# EAGLE schematic esp32-plc (EAGLE 9.6.2)

## Sheet 1 of 2
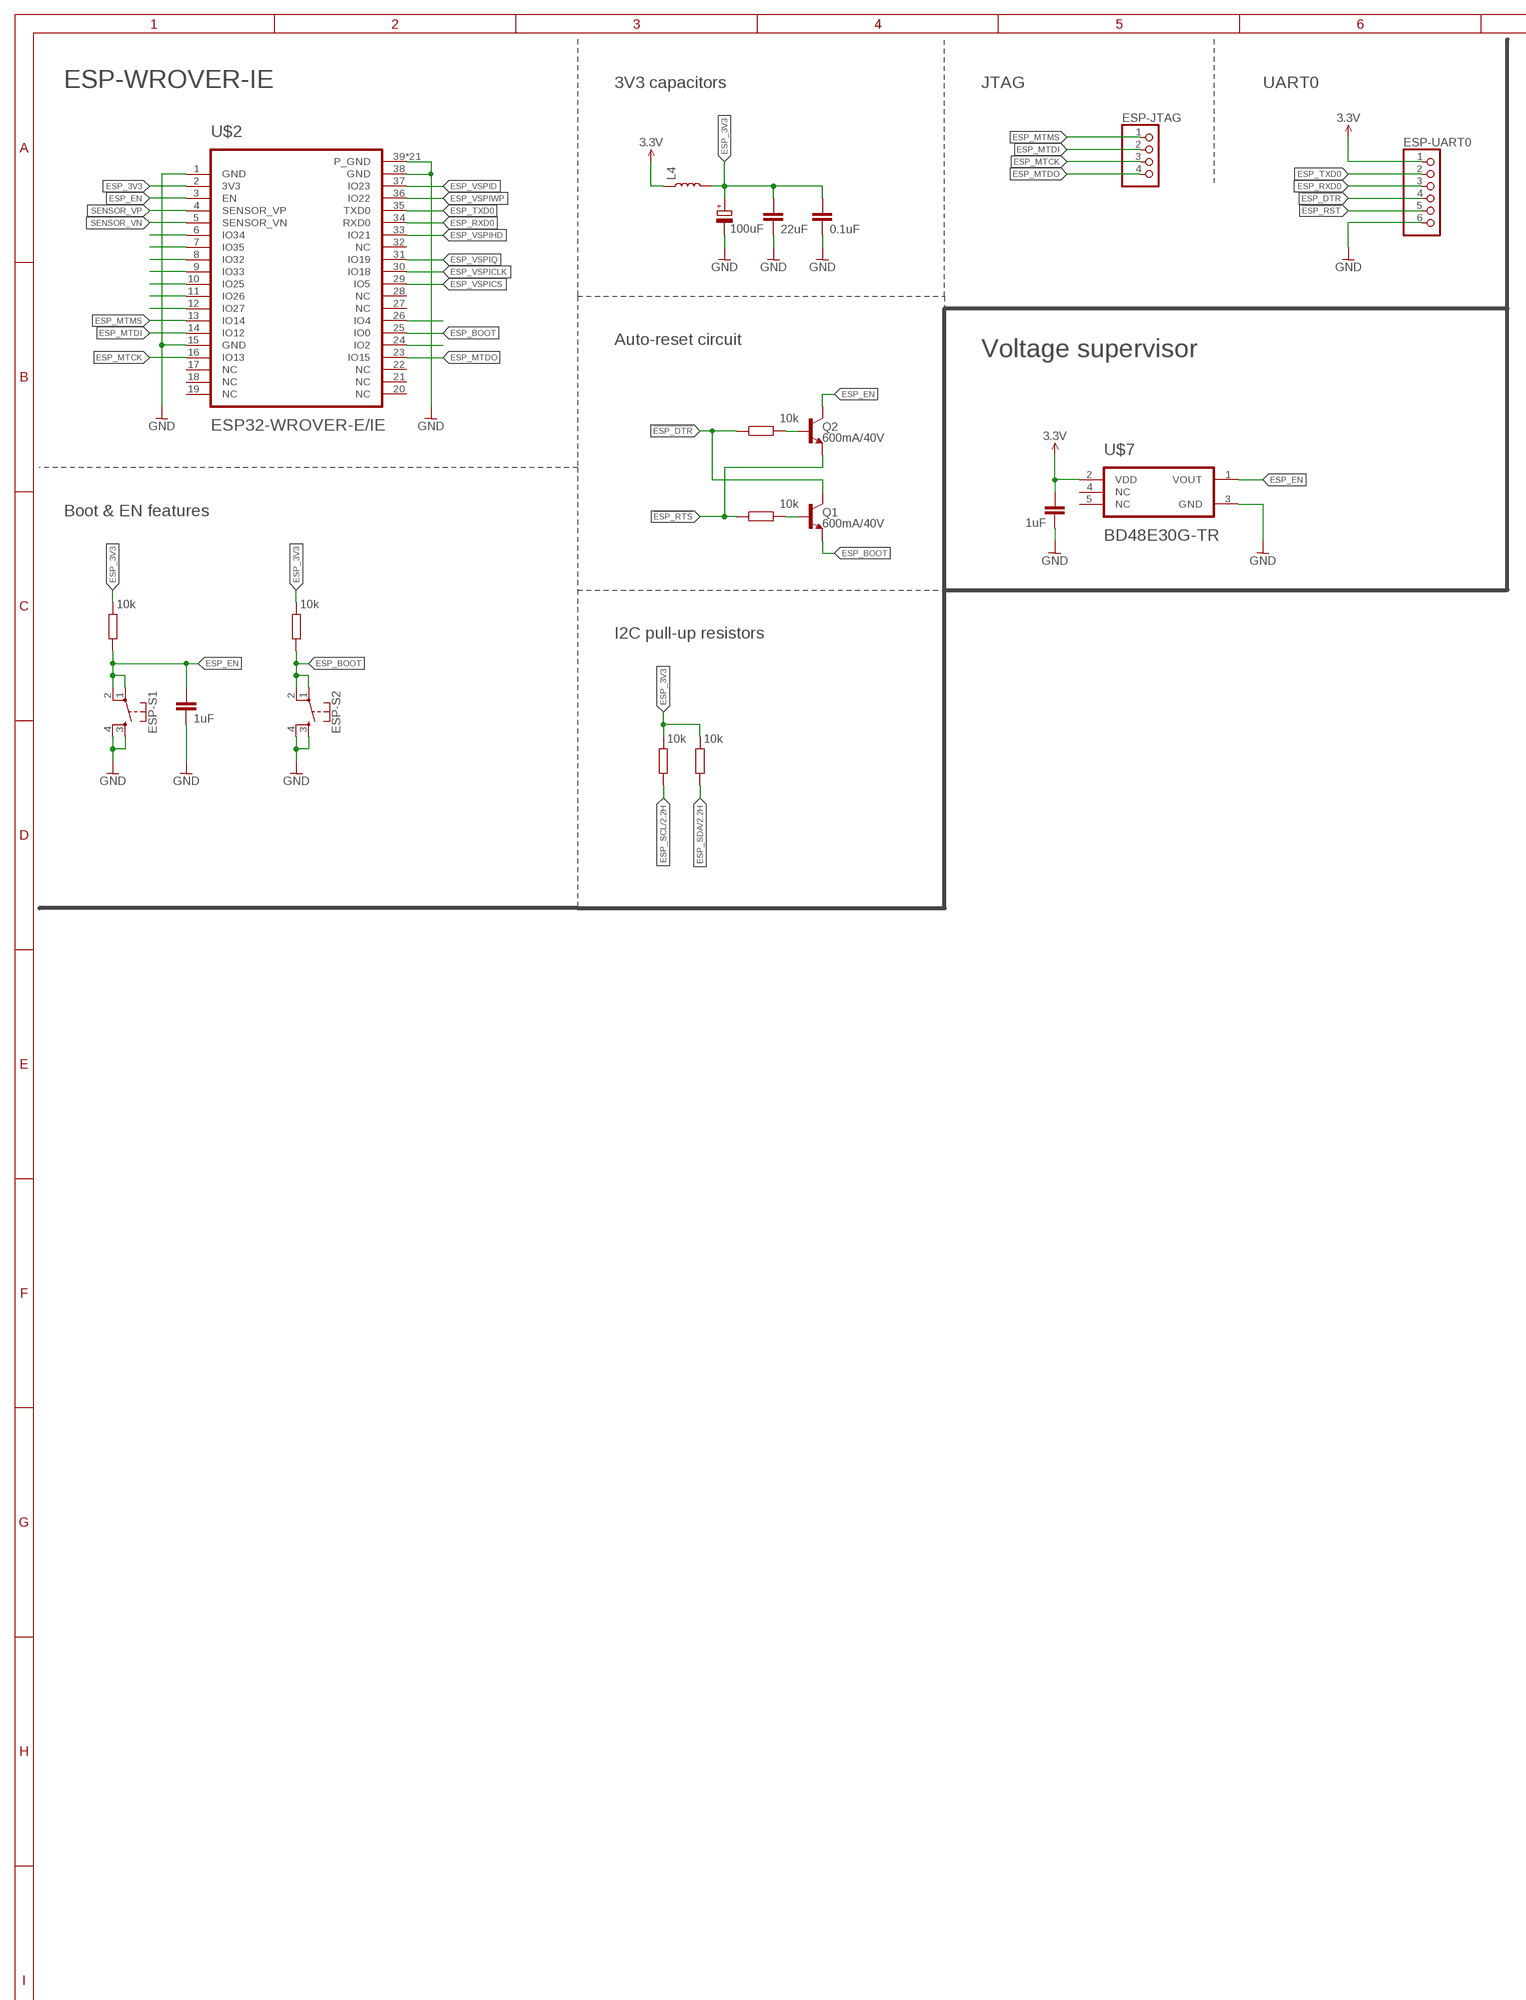
[diagram p0: schematic, sheet 1, part 1 of 2]
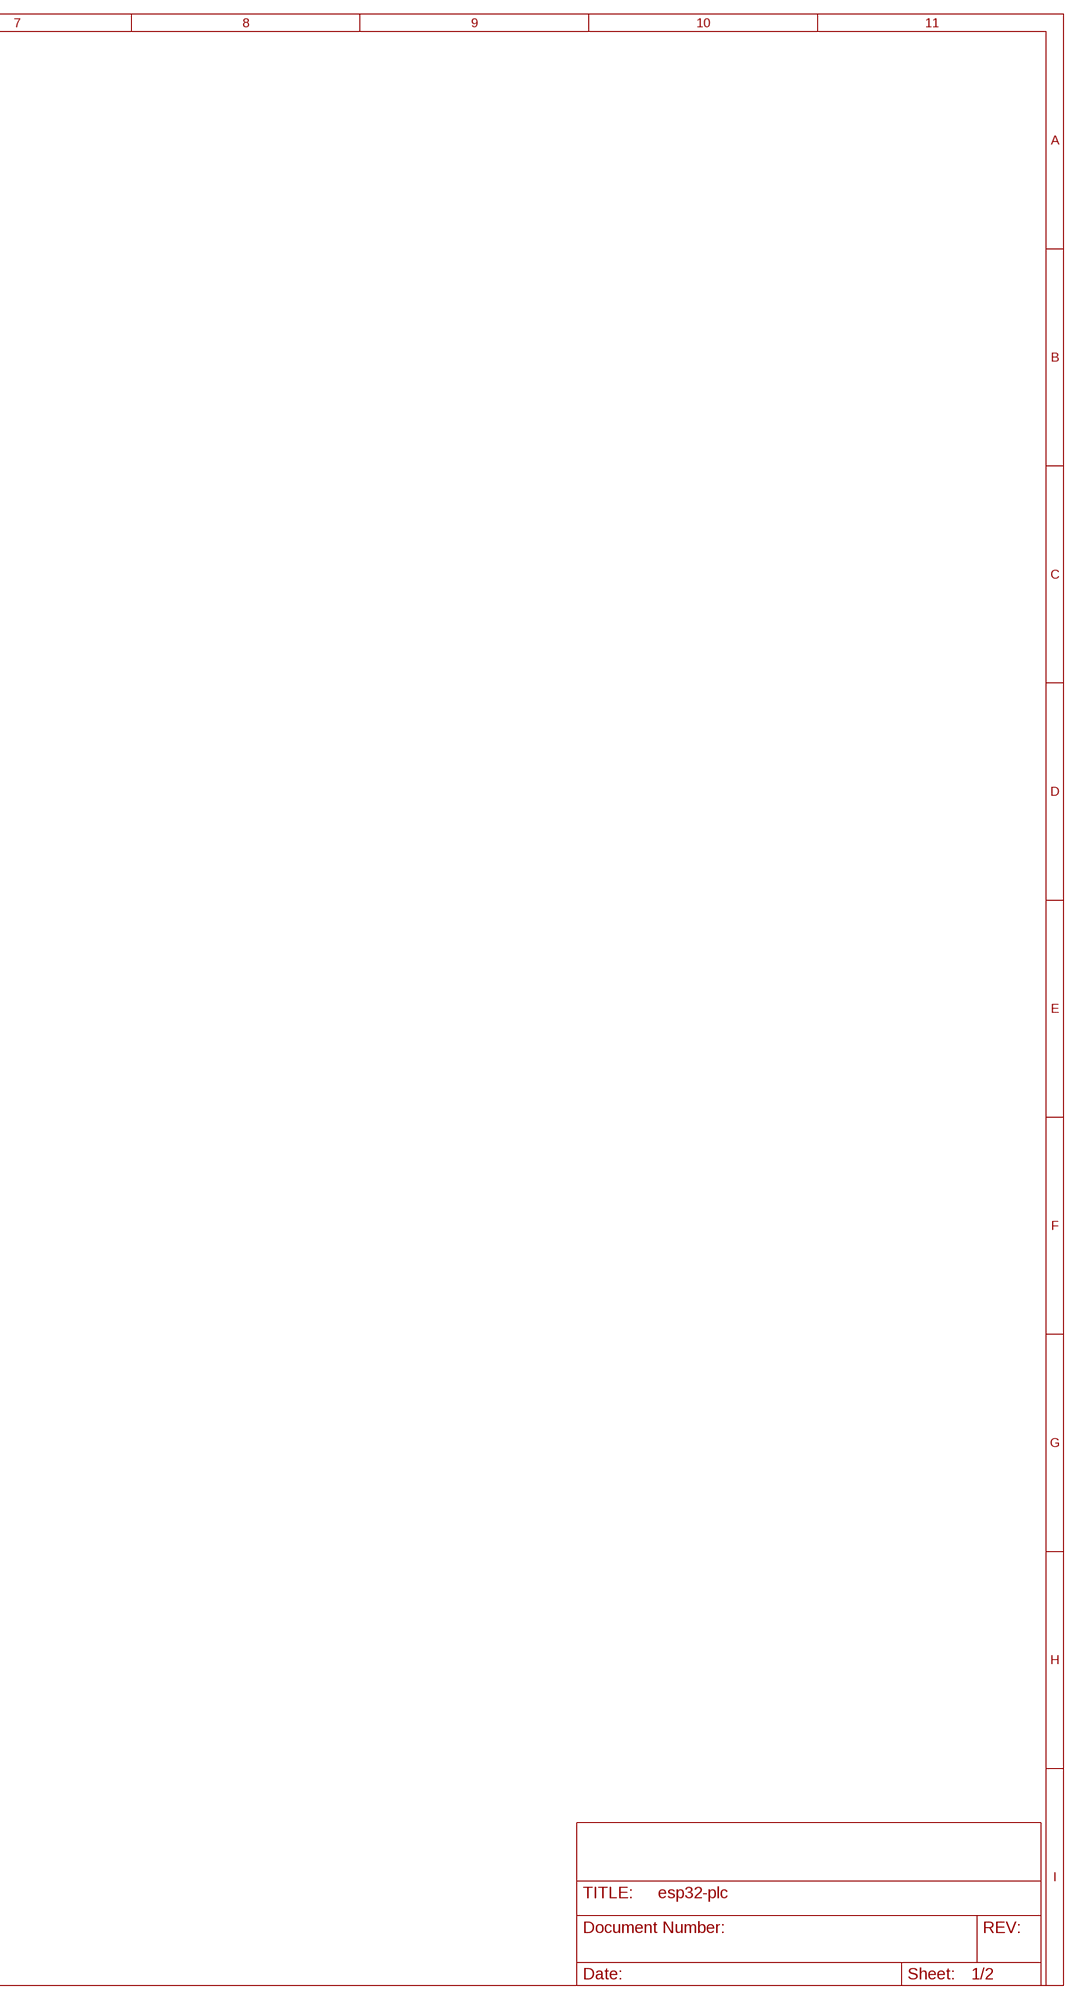
[diagram p1: schematic, sheet 1, part 2 of 2]

### Parts
ESP-C1  22uF  C-EUC0402  [C0402]
ESP-C2  0.1uF  C-EUC0402  [C0402]
ESP-C3  1uF  C-EUC0402  [C0402]
ESP-JTAG  PINHD-1X4  [1X04]
ESP-R1  10k  R-EU_R0402  [R0402]
ESP-R2  10k  R-EU_R0402  [R0402]
ESP-R3  10k  R-EU_R0402  [R0402]
ESP-R4  10k  R-EU_R0402  [R0402]
ESP-R5  10k  R-EU_R0402  [R0402]
ESP-R6  10k  R-EU_R0402  [R0402]
ESP-S1  MOMENTARY-SWITCH-SPST-2-SMD-4.6X2.8MM  [TACTILE_SWITCH_SMD_4.6X2.8MM]
ESP-S2  MOMENTARY-SWITCH-SPST-2-SMD-4.6X2.8MM  [TACTILE_SWITCH_SMD_4.6X2.8MM]
ESP-UART0  PINHD-1X6  [1X06]
L4  INDUCTOR  [XFL4020]
LTE-VBAT-C11  100uF  CPOL-EUC/6032-28R  [C/6032-28R]
Q1  600mA/40V  TRANS_NPN-MMBT2222AL  [SOT23-3]
Q2  600mA/40V  TRANS_NPN-MMBT2222AL  [SOT23-3]
U$2  ESP32-WROVER-E/IE  [ESP32-WROVER-E/IE]
U$7  BD48E30G-TR  [SSOP5]
VS-C1  1uF  C-EUC0402  [C0402]

### Nets
3.3V: ESP-UART0.1 L4.P$1 U$7.2(VDD) VS-C1.1 ; also sheet 2
!ESP_DTR: ESP-R1.1 ESP-UART0.4 Q1.3(C)
!ESP_RST: ESP-UART0.5
!ESP_RTS: ESP-R2.1 Q2.2(E)
ESP_3V3: ESP-C1.1 ESP-C2.1 ESP-R3.2 ESP-R4.2 ESP-R5.2 ESP-R6.2 L4.P$2 LTE-VBAT-C11.+ U$2.2(3V3)
ESP_BOOT: ESP-R4.1 ESP-S2.1 ESP-S2.2 Q1.2(E) U$2.25(IO0)
ESP_EN: ESP-C3.1 ESP-R3.1 ESP-S1.1 ESP-S1.2 Q2.3(C) U$2.3(EN) U$7.1(VOUT)
ESP_MTCK: ESP-JTAG.3 U$2.16(IO13)
ESP_MTDI: ESP-JTAG.2 U$2.14(IO12)
ESP_MTDO: ESP-JTAG.4 U$2.23(IO15)
ESP_MTMS: ESP-JTAG.1 U$2.13(IO14)
ESP_RXD0: ESP-UART0.3 U$2.34(RXD0)
ESP_SCL: ESP-R5.1 ; also sheet 2
ESP_SDA: ESP-R6.1 ; also sheet 2
ESP_TXD0: ESP-UART0.2 U$2.35(TXD0)
ESP_VSPICLK: U$2.30(IO18)
ESP_VSPICS: U$2.29(IO5)
ESP_VSPID: U$2.37(IO23)
ESP_VSPIHD: U$2.33(IO21)
ESP_VSPIQ: U$2.31(IO19)
ESP_VSPIWP: U$2.36(IO22)
GND: ESP-C1.2 ESP-C2.2 ESP-C3.2 ESP-S1.3 ESP-S1.4 ESP-S2.3 ESP-S2.4 ESP-UART0.6 LTE-VBAT-C11.- U$2.1(GND) U$2.15(GND) U$2.38(GND) U$2.39(P_GND) U$2.40(P_GND) U$2.41(P_GND) U$2.42(P_GND) U$2.43(P_GND) U$2.44(P_GND) U$2.45(P_GND) U$2.46(P_GND) U$2.47(P_GND) U$2.48(P_GND) U$2.49(P_GND) U$2.50(P_GND) U$2.51(P_GND) U$2.52(P_GND) U$2.53(P_GND) U$2.54(P_GND) U$2.55(P_GND) U$2.56(P_GND) U$2.57(P_GND) U$2.58(P_GND) U$2.59(P_GND) U$7.3(GND) VS-C1.2 ; also sheet 2
N$14: U$2.12(IO27)
N$15: U$2.11(IO26)
N$16: U$2.10(IO25)
N$17: U$2.9(IO33)
N$18: U$2.8(IO32)
N$19: U$2.7(IO35)
N$20: U$2.6(IO34)
N$27: U$2.26(IO4)
N$29: ESP-R2.2 Q1.1(B)
N$30: ESP-R1.2 Q2.1(B)
N$31: U$2.24(IO2)
SENSOR_VN: U$2.5(SENSOR_VN)
SENSOR_VP: U$2.4(SENSOR_VP)
Unconnected: U$2.17(NC) U$2.18(NC) U$2.19(NC) U$2.20(NC) U$2.21(NC) U$2.22(NC) U$2.27(NC) U$2.28(NC) U$2.32(NC) U$7.4(NC) U$7.5(NC)

### Notes on the sheet
- ESP-WROVER-IE | 3V3 capacitors | JTAG | UART0
- Auto-reset circuit
- Voltage supervisor
- Boot & EN features
- I2C pull-up resistors

## Sheet 2 of 2
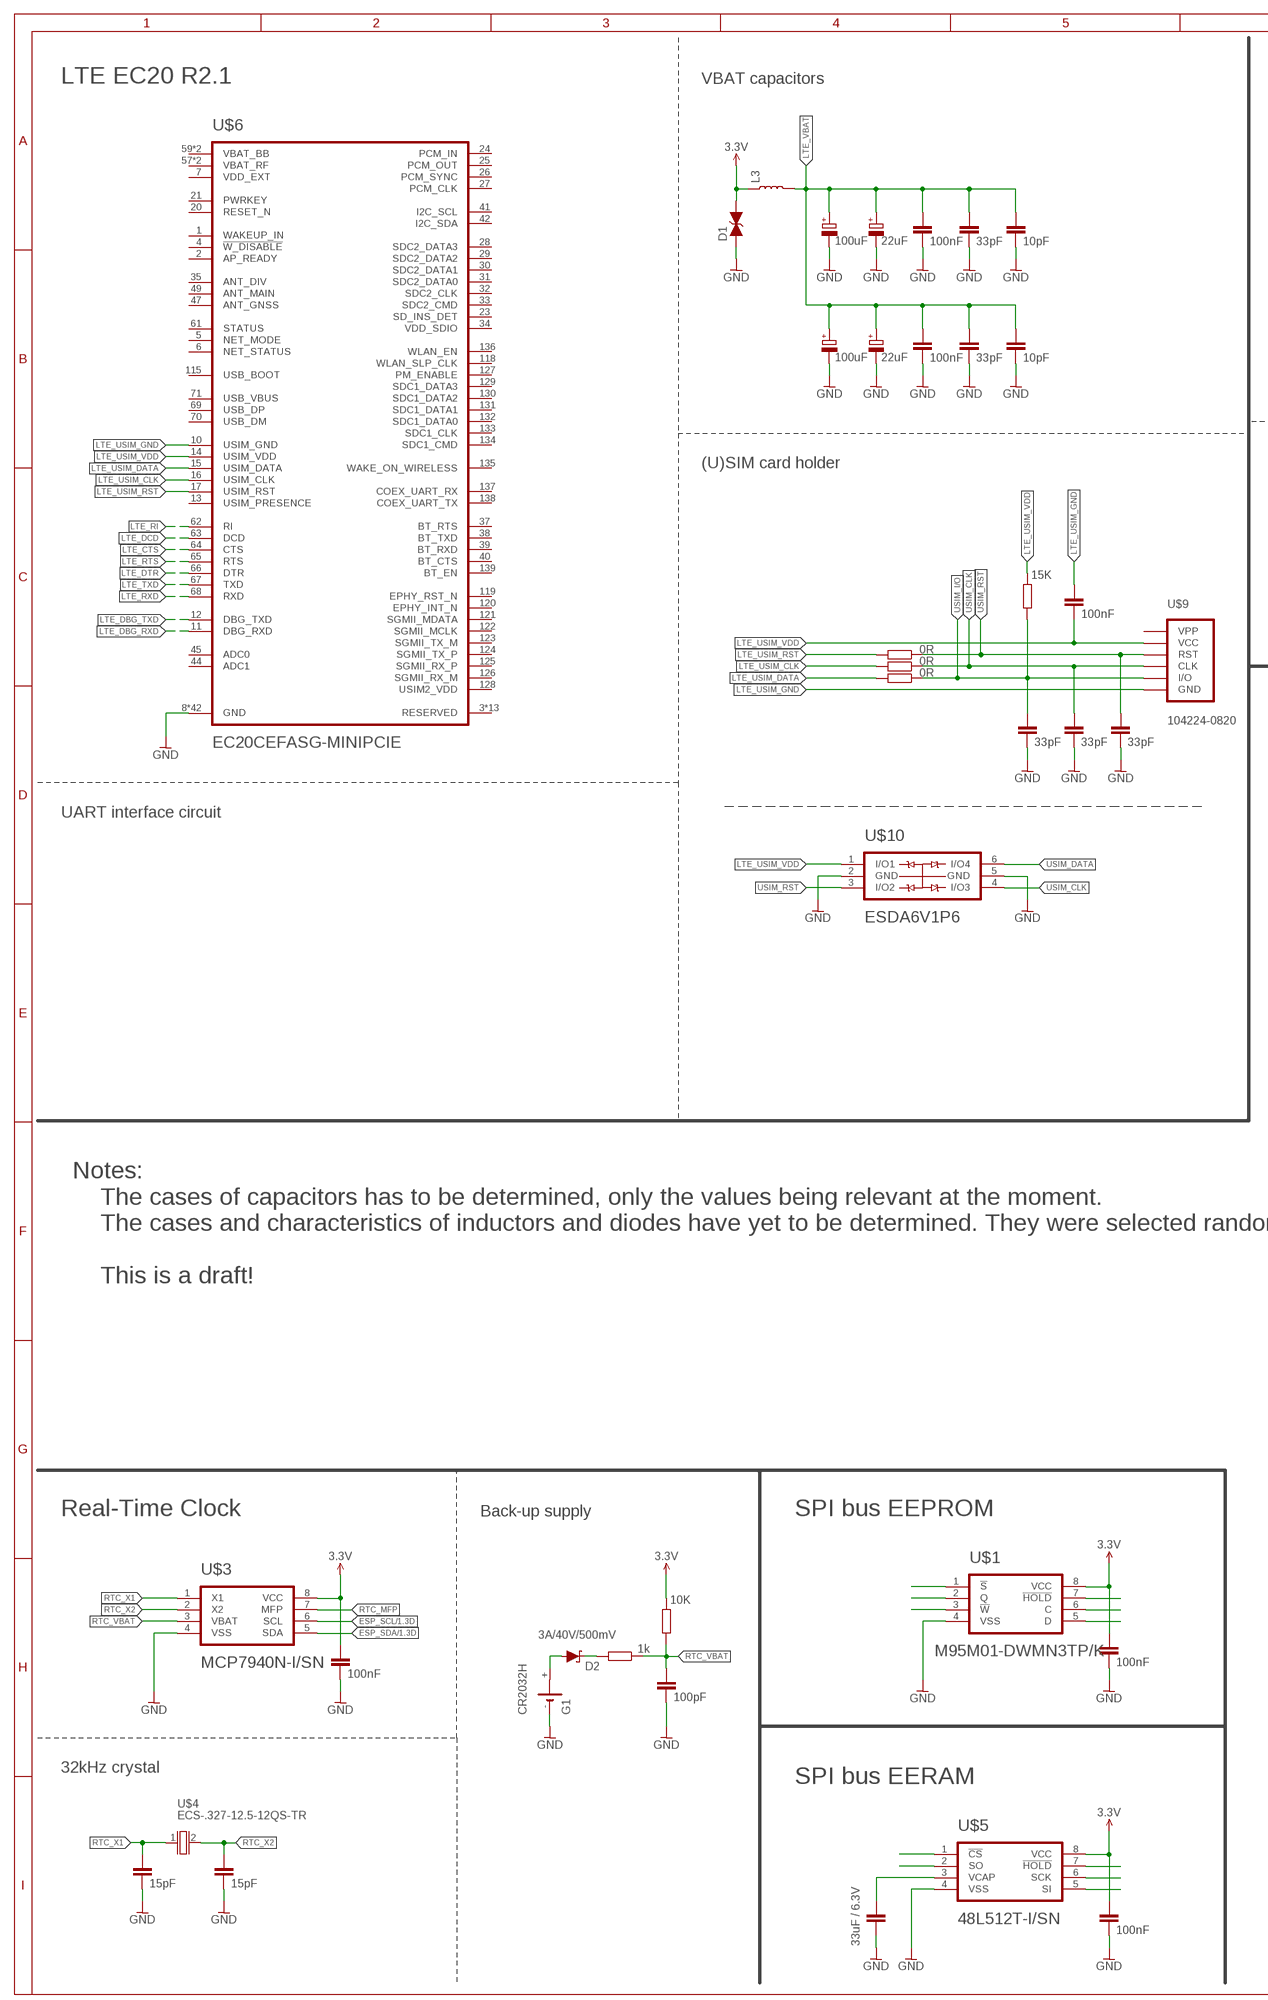
[diagram p2: schematic, sheet 2, part 1 of 2]
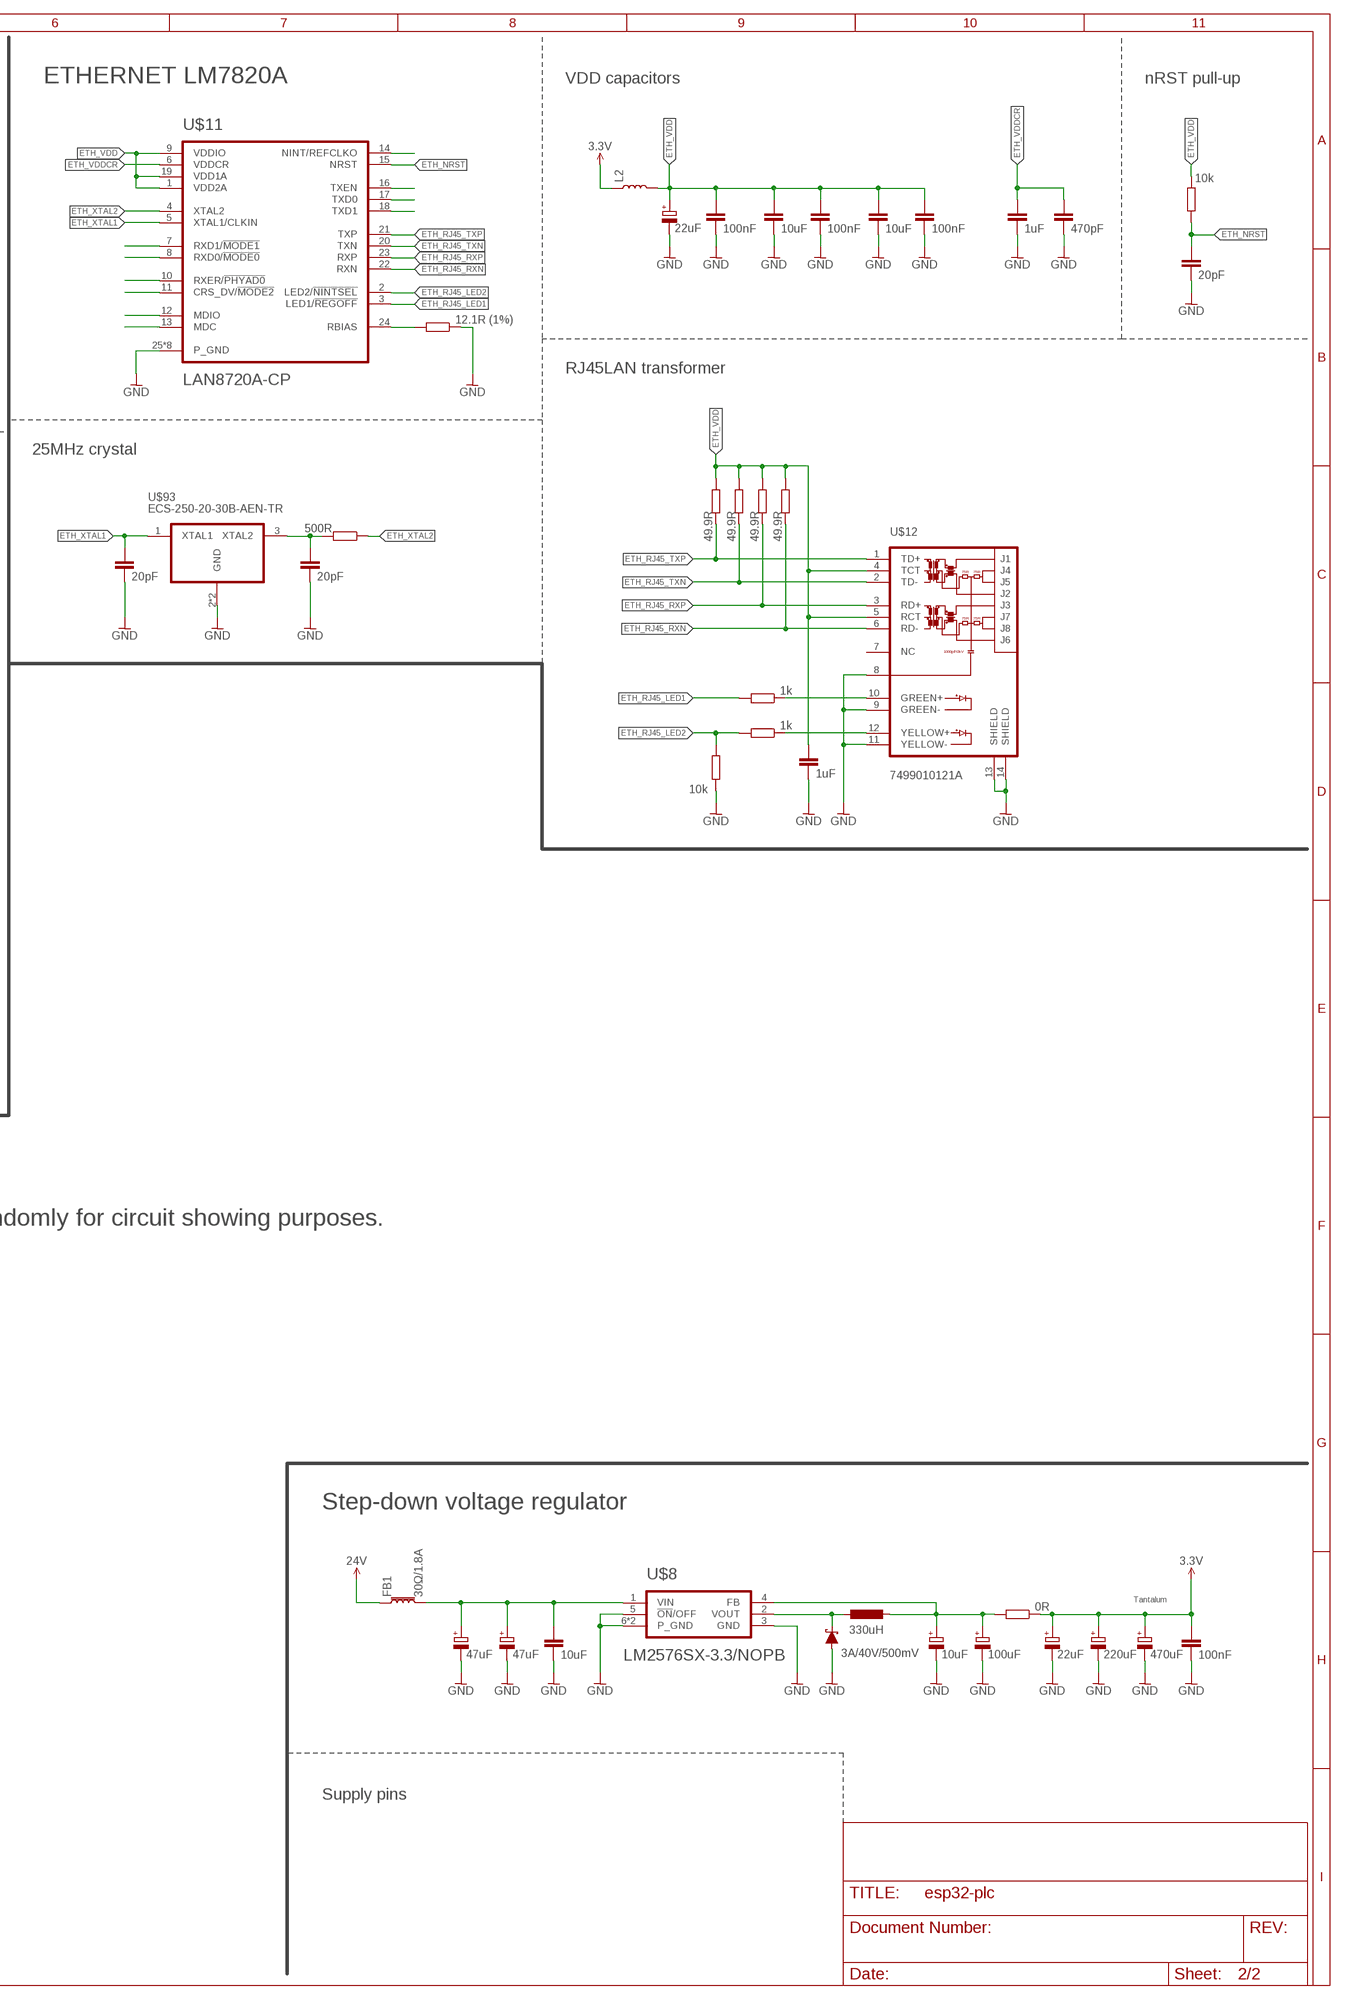
[diagram p3: schematic, sheet 2, part 2 of 2]

### Parts
C4-RTC  100pF  C-EUC0402  [C0402]
D1  24V  DIODE_TVS  [0603]
D2  3A/40V/500mV  DIODE-SCHOTTKY-B340A  [SMA-DIODE]
D3  3A/40V/500mV  DIODE-SCHOTTKY-B340A  [SMA-DIODE]
EEPROM-C1  100nF  C-EUC0402  [C0402]
EERAM-C1  100nF  C-EUC0402  [C0402]
EERAM-C2  33uF / 6.3V  C-EUC0402  [C0402]
ETH-RJ45-C1  1uF  C-EUC0402  [C0402]
ETH-RJ45-R1  49.9R  R-EU_R0402  [R0402]
ETH-RJ45-R2  49.9R  R-EU_R0402  [R0402]
ETH-RJ45-R3  49.9R  R-EU_R0402  [R0402]
ETH-RJ45-R4  49.9R  R-EU_R0402  [R0402]
ETH-RJ45-R5  1k  R-EU_R0402  [R0402]
ETH-RJ45-R6  1k  R-EU_R0402  [R0402]
ETH-RJ45-R7  12.1R (1%)  R-EU_R0402  [R0402]
ETH-RJ45-R8  500R  R-EU_R0402  [R0402]
ETH-RJ45-R9  10k  R-EU_R0402  [R0402]
ETH-RJ45-R10  10k  R-EU_R0402  [R0402]
ETH-VDD1A-C1  10uF  C-EUC0402  [C0402]
ETH-VDD1A-C2  100nF  C-EUC0402  [C0402]
ETH-VDD2A-C1  10uF  C-EUC0402  [C0402]
ETH-VDD2A-C2  100nF  C-EUC0402  [C0402]
ETH-VDD2A-C3  20pF  C-EUC0402  [C0402]
ETH-VDD2A-C4  20pF  C-EUC0402  [C0402]
ETH-VDD2A-C5  20pF  C-EUC0402  [C0402]
ETH-VDDCR-C1  1uF  C-EUC0402  [C0402]
ETH-VDDCR-C2  470pF  C-EUC0402  [C0402]
ETH-VDDIO-C1  22uF  CPOL-EUC/6032-28R  [C/6032-28R]
ETH-VDDIO-C2  100nF  C-EUC0402  [C0402]
FB1  30Ω/1.8A  FERRITE_BEAD-0603  [0603]
G1  CR2032H  [CR2032H]
L1  330uH  L-EUL1812  [L1812]
L2  INDUCTOR  [XFL4020]
L3  INDUCTOR  [XFL4020]
LTE-USIM-C1  100nF  C-EUC0402  [C0402]
LTE-USIM-C2  33pF  C-EUC0402  [C0402]
LTE-USIM-C3  33pF  C-EUC0402  [C0402]
LTE-USIM-C4  33pF  C-EUC0402  [C0402]
LTE-USIM-R1  15K  R-EU_R0402  [R0402]
LTE-USIM-R2  0R  R-EU_R0402  [R0402]
LTE-USIM-R3  0R  R-EU_R0402  [R0402]
LTE-USIM-R4  0R  R-EU_R0402  [R0402]
LTE-VBAT-C1  100uF  CPOL-EUC/6032-28R  [C/6032-28R]
LTE-VBAT-C2  100nF  C-EUC0402  [C0402]
LTE-VBAT-C3  33pF  C-EUC0402  [C0402]
LTE-VBAT-C4  10pF  C-EUC0402  [C0402]
LTE-VBAT-C5  100uF  CPOL-EUC/6032-28R  [C/6032-28R]
LTE-VBAT-C6  100nF  C-EUC0402  [C0402]
LTE-VBAT-C7  33pF  C-EUC0402  [C0402]
LTE-VBAT-C8  10pF  C-EUC0402  [C0402]
LTE-VBAT-C9  22uF  CPOL-EUC/6032-28R  [C/6032-28R]
LTE-VBAT-C10  22uF  CPOL-EUC/6032-28R  [C/6032-28R]
PSU-IN-C1  47uF  CPOL-EUC/6032-28R  [C/6032-28R]
PSU-IN-C2  47uF  CPOL-EUC/6032-28R  [C/6032-28R]
PSU-IN-C3  10uF  C-EUC0402  [C0402]
PSU-OUT-C1  10uF  CPOL-EUC/6032-28R  [C/6032-28R]
PSU-OUT-C2  100uF  CPOL-EUC/6032-28R  [C/6032-28R]
PSU-OUT-C3  22uF  CPOL-EUC/6032-28R  [C/6032-28R]
PSU-OUT-C4  220uF  CPOL-EUC/6032-28R  [C/6032-28R]
PSU-OUT-C5  470uF  CPOL-EUC/6032-28R  [C/6032-28R]
PSU-OUT-C6  100nF  C-EUC0402  [C0402]
PSU-OUT-R1  0R  R-EU_R0402  [R0402]
R1-RTC  10K  R-EU_R0402  [R0402]
R1-RTC1  1k  R-EU_R0402  [R0402]
RTC-C1  100nF  C-EUC0402  [C0402]
RTC-C2  15pF  C-EUC0402  [C0402]
RTC-C3  15pF  C-EUC0402  [C0402]
U$1  M95M01-DWMN3TP/K  [SO8]
U$3  MCP7940N-I/SN  [SOIC-8]
U$4  ECS-.327-12.5-12QS-TR  [2X1.2]
U$5  48L512T-I/SN  [SOIC-8]
U$6  EC20CEFASG-MINIPCIE  [EC20-R2.1]
U$8  LM2576SX-3.3/NOPB  [TO-263-5]
U$9  104224-0820  [104224-0820]
U$10  ESDA6V1P6  [SOT-666]
U$11  LAN8720A-CP  [QFN-24(4X4MM)]
U$12  7499010121A  [RJ45-7499010121A]
U$93  ECS-250-20-30B-AEN-TR  [3.2X5MM]

### Nets
3.3V: D1.2(C) EEPROM-C1.1 EERAM-C1.1 L2.P$1 L3.P$1 PSU-OUT-C3.+ PSU-OUT-C4.+ PSU-OUT-C5.+ PSU-OUT-C6.1 PSU-OUT-R1.1 R1-RTC.2 RTC-C1.1 U$1.8(VCC) U$3.8(VCC) U$5.8(VCC) ; also sheet 1
24V: FB1.1
EERAM_VCAP: EERAM-C2.1 U$5.3(VCAP)
ESP_SCL: U$3.6(SCL) ; also sheet 1
ESP_SDA: U$3.5(SDA) ; also sheet 1
ETH_NRST: ETH-RJ45-R9.1 ETH-VDD2A-C5.1 U$11.15(NRST)
ETH_RJ45_LED1: ETH-RJ45-R5.2 U$11.3(LED1/!REGOFF)
ETH_RJ45_LED2: ETH-RJ45-R6.2 ETH-RJ45-R10.2 U$11.2(LED2/!NINTSEL)
ETH_RJ45_RXN: ETH-RJ45-R4.2 U$11.22(RXN) U$12.6(RD-)
ETH_RJ45_RXP: ETH-RJ45-R3.2 U$11.23(RXP) U$12.3(RD+)
ETH_RJ45_TXN: ETH-RJ45-R2.2 U$11.20(TXN) U$12.2(TD-)
ETH_RJ45_TXP: ETH-RJ45-R1.2 U$11.21(TXP) U$12.1(TD+)
ETH_VDD: ETH-RJ45-C1.1 ETH-RJ45-R1.1 ETH-RJ45-R2.1 ETH-RJ45-R3.1 ETH-RJ45-R4.1 ETH-RJ45-R9.2 ETH-VDD1A-C1.1 ETH-VDD1A-C2.1 ETH-VDD2A-C1.1 ETH-VDD2A-C2.1 ETH-VDDIO-C1.+ ETH-VDDIO-C2.1 L2.P$2 U$11.1(VDD2A) U$11.9(VDDIO) U$11.19(VDD1A) U$12.4(TCT) U$12.5(RCT)
ETH_VDDCR: ETH-VDDCR-C1.1 ETH-VDDCR-C2.1 U$11.6(VDDCR)
ETH_XTAL1: ETH-VDD2A-C3.1 U$11.5(XTAL1/CLKIN) U$93.1(XTAL1)
ETH_XTAL2: ETH-RJ45-R8.1 U$11.4(XTAL2)
GND: C4-RTC.2 D1.1(A) D3.A EEPROM-C1.2 EERAM-C1.2 EERAM-C2.2 ETH-RJ45-C1.2 ETH-RJ45-R7.1 ETH-RJ45-R10.1 ETH-VDD1A-C1.2 ETH-VDD1A-C2.2 ETH-VDD2A-C1.2 ETH-VDD2A-C2.2 ETH-VDD2A-C3.2 ETH-VDD2A-C4.2 ETH-VDD2A-C5.2 ETH-VDDCR-C1.2 ETH-VDDCR-C2.2 ETH-VDDIO-C1.- ETH-VDDIO-C2.2 G1.- LTE-USIM-C2.2 LTE-USIM-C3.2 LTE-USIM-C4.2 LTE-VBAT-C1.- LTE-VBAT-C2.2 LTE-VBAT-C3.2 LTE-VBAT-C4.2 LTE-VBAT-C5.- LTE-VBAT-C6.2 LTE-VBAT-C7.2 LTE-VBAT-C8.2 LTE-VBAT-C9.- LTE-VBAT-C10.- PSU-IN-C1.- PSU-IN-C2.- PSU-IN-C3.2 PSU-OUT-C1.- PSU-OUT-C2.- PSU-OUT-C3.- PSU-OUT-C4.- PSU-OUT-C5.- PSU-OUT-C6.2 RTC-C1.2 RTC-C2.2 RTC-C3.2 U$1.4(VSS) U$3.4(VSS) U$5.4(VSS) U$6.8(GND) U$6.9(GND) U$6.19(GND) U$6.22(GND) U$6.36(GND) U$6.46(GND) U$6.48(GND) U$6.50(GND) U$6.51(GND) U$6.52(GND) U$6.53(GND) U$6.54(GND) U$6.56(GND) U$6.72(GND) U$6.85(GND) U$6.86(GND) U$6.87(GND) U$6.88(GND) U$6.89(GND) U$6.90(GND) U$6.91(GND) U$6.92(GND) U$6.93(GND) U$6.94(GND) U$6.95(GND) U$6.96(GND) U$6.97(GND) U$6.98(GND) U$6.99(GND) U$6.100(GND) U$6.101(GND) U$6.102(GND) U$6.103(GND) U$6.104(GND) U$6.105(GND) U$6.106(GND) U$6.107(GND) U$6.108(GND) U$6.109(GND) U$6.110(GND) U$6.111(GND) U$6.112(GND) U$8.3(GND) U$8.5(!ON!/OFF) U$8.6(P_GND) U$8.7(P_GND) U$10.2(GND) U$10.5(GND) U$11.25(P_GND) U$11.26(P_GND) U$11.27(P_GND) U$11.28(P_GND) U$11.29(P_GND) U$11.30(P_GND) U$11.31(P_GND) U$11.32(P_GND) U$12.8 U$12.9(GREEN-) U$12.11(YELLOW-) U$12.13(SHIELD) U$12.14(SHIELD) U$93.2(GND) U$93.4(GND) ; also sheet 1
LTE_CTS: U$6.64(CTS)
LTE_DBG_RXD: U$6.11(DBG_RXD)
LTE_DBG_TXD: U$6.12(DBG_TXD)
LTE_DCD: U$6.63(DCD)
LTE_DTR: U$6.66(DTR)
LTE_RI: U$6.62(RI)
LTE_RTS: U$6.65(RTS)
LTE_RXD: U$6.68(RXD)
LTE_TXD: U$6.67(TXD)
LTE_USIM_CLK: LTE-USIM-R3.2 U$6.16(USIM_CLK)
LTE_USIM_DATA: LTE-USIM-R2.2 U$6.15(USIM_DATA)
LTE_USIM_GND: LTE-USIM-C1.1 U$6.10(USIM_GND) U$9.G1(GND) U$9.G2(GND) U$9.G3(GND) U$9.G4(GND) U$9.S4(GND)
LTE_USIM_RST: LTE-USIM-R4.2 U$6.17(USIM_RST)
LTE_USIM_VDD: LTE-USIM-C1.2 LTE-USIM-R1.2 U$6.14(USIM_VDD) U$9.S1(VCC) U$10.1(I/O1)
LTE_VBAT: L3.P$2 LTE-VBAT-C1.+ LTE-VBAT-C2.1 LTE-VBAT-C3.1 LTE-VBAT-C4.1 LTE-VBAT-C5.+ LTE-VBAT-C6.1 LTE-VBAT-C7.1 LTE-VBAT-C8.1 LTE-VBAT-C9.+ LTE-VBAT-C10.+
N$1: U$5.7(!HOLD)
N$2: U$5.6(SCK)
N$3: U$1.7(!HOLD)
N$4: U$1.6(C)
N$5: U$1.5(D)
N$6: D2.C R1-RTC1.2
N$7: D2.A G1.+
N$8: U$1.1(!S)
N$9: U$1.2(Q)
N$10: U$1.3(!W)
N$11: U$5.5(SI)
N$12: FB1.2 PSU-IN-C1.+ PSU-IN-C2.+ PSU-IN-C3.1 U$8.1(VIN)
N$13: U$5.1(!CS)
N$21: U$5.2(SO)
N$22: L1.2 PSU-OUT-C1.+ PSU-OUT-C2.+ PSU-OUT-R1.2 U$8.4(FB)
N$23: D3.C L1.1 U$8.2(VOUT)
N$25: ETH-RJ45-R7.2 U$11.24(RBIAS)
N$26: U$11.10(RXER/!PHYAD0)
N$28: U$11.11(CRS_DV/!MODE2)
N$32: U$11.12(MDIO)
N$33: U$11.13(MDC)
N$34: U$11.16(TXEN)
N$35: U$11.17(TXD0)
N$36: ETH-RJ45-R5.1 U$12.10(GREEN+)
N$37: U$11.18(TXD1)
N$38: ETH-RJ45-R6.1 U$12.12(YELLOW+)
N$39: U$11.7(RXD1/!MODE1)
N$40: U$11.8(RXD0/!MODE0)
N$42: U$11.14(NINT/REFCLKO)
N$44: ETH-RJ45-R8.2 ETH-VDD2A-C4.1 U$93.3(XTAL2)
RTC_MFP: U$3.7(MFP)
RTC_VBAT: C4-RTC.1 R1-RTC1.1 R1-RTC.1 U$3.3(VBAT)
RTC_X1: RTC-C2.1 U$3.1(X1) U$4.1
RTC_X2: RTC-C3.1 U$3.2(X2) U$4.2
USIM_CLK: LTE-USIM-C3.1 LTE-USIM-R3.1 U$9.S3(CLK) U$10.4(I/O3)
USIM_DATA: U$10.6(I/O4)
USIM_I/O: LTE-USIM-C2.1 LTE-USIM-R1.1 LTE-USIM-R2.1 U$9.S6(I/O)
USIM_RST: LTE-USIM-C4.1 LTE-USIM-R4.1 U$9.S2(RST) U$10.3(I/O2)
Unconnected: G1.+@1(+) U$6.1(WAKEUP_IN) U$6.2(AP_READY) U$6.3(RESERVED) U$6.4(!W_DISABLE) U$6.5(NET_MODE) U$6.6(NET_STATUS) U$6.7(VDD_EXT) U$6.13(USIM_PRESENCE) U$6.18(RESERVED) U$6.20(RESET_N) U$6.21(PWRKEY) U$6.23(SD_INS_DET) U$6.24(PCM_IN) U$6.25(PCM_OUT) U$6.26(PCM_SYNC) U$6.27(PCM_CLK) U$6.28(SDC2_DATA3) U$6.29(SDC2_DATA2) U$6.30(SDC2_DATA1) U$6.31(SDC2_DATA0) U$6.32(SDC2_CLK) U$6.33(SDC2_CMD) U$6.34(VDD_SDIO) U$6.35(ANT_DIV) U$6.37(BT_RTS) U$6.38(BT_TXD) U$6.39(BT_RXD) U$6.40(BT_CTS) U$6.41(I2C_SCL) U$6.42(I2C_SDA) U$6.43(RESERVED) U$6.44(ADC1) U$6.45(ADC0) U$6.47(ANT_GNSS) U$6.49(ANT_MAIN) U$6.55(RESERVED) U$6.57(VBAT_RF) U$6.58(VBAT_RF) U$6.59(VBAT_BB) U$6.60(VBAT_BB) U$6.61(STATUS) U$6.69(USB_DP) U$6.70(USB_DM) U$6.71(USB_VBUS) U$6.113(RESERVED) U$6.114(RESERVED) U$6.115(USB_BOOT) U$6.116(RESERVED) U$6.117(RESERVED) U$6.118(WLAN_SLP_CLK) U$6.119(EPHY_RST_N) U$6.120(EPHY_INT_N) U$6.121(SGMII_MDATA) U$6.122(SGMII_MCLK) U$6.123(SGMII_TX_M) U$6.124(SGMII_TX_P) U$6.125(SGMII_RX_P) U$6.126(SGMII_RX_M) U$6.127(PM_ENABLE) U$6.128(USIM2_VDD) U$6.129(SDC1_DATA3) U$6.130(SDC1_DATA2) U$6.131(SDC1_DATA1) U$6.132(SDC1_DATA0) U$6.133(SDC1_CLK) U$6.134(SDC1_CMD) U$6.135(WAKE_ON_WIRELESS) U$6.136(WLAN_EN) U$6.137(COEX_UART_RX) U$6.138(COEX_UART_TX) U$6.139(BT_EN) U$6.140(RESERVED) U$6.141(RESERVED) U$6.142(RESERVED) U$6.143(RESERVED) U$6.144(RESERVED) U$9.S5(VPP) U$12.7(NC)

### Notes on the sheet
- LTE EC20 R2.1 | VBAT capacitors | ETHERNET LM7820A | VDD capacitors | nRST pull-up
- RJ45LAN transformer
- 25MHz crystal
- (U)SIM card holder
- UART interface circuit
- Notes:
      The cases of capacitors has to be determined, only the values being relevant at the moment.
      The cases and characteristics of inductors and diodes have yet to be determined. They were selected randomly for circuit showing purposes.
  
      This is a draft!
- Real-Time Clock | Back-up supply | SPI bus EEPROM | Step-down voltage regulator
- Tantalum
- 32kHz crystal
- SPI bus EERAM
- Supply pins

## Library data of the parts
C4-RTC EEPROM-C1 EERAM-C1 EERAM-C2 ESP-C1-ESP-C3 ETH-RJ45-C1 ETH-VDD1A-C1 ETH-VDD1A-C2 ETH-VDD2A-C1-ETH-VDD2A-C5 ETH-VDDCR-C1 ETH-VDDCR-C2 ETH-VDDIO-C2 LTE-USIM-C1-LTE-USIM-C4 LTE-VBAT-C2-LTE-VBAT-C4 LTE-VBAT-C6-LTE-VBAT-C8 PSU-IN-C3 PSU-OUT-C6 RTC-C1-RTC-C3 VS-C1 = rcl:C-EU: CAPACITOR, European symbol; SPICEPREFIX: C
D1 = SparkFun-DiscreteSemi:DIODE_TVS; PROD_ID: DIO-14502
D2 D3 = SparkFun-DiscreteSemi:DIODE-SCHOTTKY: Schottky diode A Schottky diode is a semiconductor diode which has a low forward voltage drop and a very fast switching action.; PROD_ID: DIO-09886
ESP-JTAG = pinhead:PINHD-1X4: PIN HEADER
ESP-R1-ESP-R6 ETH-RJ45-R1-ETH-RJ45-R10 LTE-USIM-R1-LTE-USIM-R4 PSU-OUT-R1 R1-RTC R1-RTC1 = rcl:R-EU_: RESISTOR, European symbol; SPICEPREFIX: R
ESP-S1 ESP-S2 = SparkFun-Switches:MOMENTARY-SWITCH-SPST-2: Momentary Switch (Pushbutton) - SPST - Two Circuits Normally-open (NO) SPST momentary switches (buttons, pushbuttons). Schematic symbol includes two switch circuits. Variants SMD-4.6MMX2.8MM - 4.60mm x 2.80mm Tactile Momentary Button Switch - Used on SparkFun SAMD21 Mini Breakout <https://www.sparkfun.com/products/13664> SMD-5.2MM - Mini Pushbutton Switch - SMD <https://www.sparkfun.com/products/8720> - Used on Arduino Pro Mini <https://www.sparkfun.com/products/11114>; PROD_ID: SWCH-13065
ESP-UART0 = pinhead:PINHD-1X6: PIN HEADER
ETH-VDDIO-C1 LTE-VBAT-C1 LTE-VBAT-C5 LTE-VBAT-C9-LTE-VBAT-C11 PSU-IN-C1 PSU-IN-C2 PSU-OUT-C1-PSU-OUT-C5 = rcl:CPOL-EU: POLARIZED CAPACITOR, European symbol; SPICEPREFIX: C
FB1 = SparkFun-Coils:FERRITE_BEAD: Ferrite Bead (blocks, cores, rings, chokes, etc.) Inductor with layers of ferrite used to suppress high frequencies. Often used to isolate high frequency noise. SparkFun Products: IOIO-OTG - V2.2 <https://www.sparkfun.com/products/13613> SparkFun SAMD21 Mini Breakout <https://www.sparkfun.com/products/13664> SparkFun 6 Degrees of Freedom Breakout - LSM6DS3 <https://www.sparkfun.com/products/13339> SparkFun SAMD21 Dev Breakout <https://www.sparkfun.com/products/13672>; PROD_ID: NDUC-13805
G1 = battery:CR2032H: LI BATTERY Varta
L1 = rcl:L-EU: INDUCTOR, European symbol; SPICEPREFIX: L
L2-L4 = SparkFun-Coils:INDUCTOR: Inductors Resist changes in electrical current. Basically a coil of wire. SparkFun Products: SparkFun Load Cell Amplifier - HX711 <https://www.sparkfun.com/products/13879> IOIO-OTG - V2.2 <https://www.sparkfun.com/products/13613>
Q1 Q2 = SparkFun-DiscreteSemi:TRANS_NPN: NPN transistor Current controlled devices typically used to amplify current or used as a switch. BC547 - COM-08928 <http://www.sparkfun.com/products/8928> (TO-92 45V 100mA) (1.Collector 2.Base 3.Emitter) 2N3904 - COM-00521 <http://www.sparkfun.com/products/521> (TO-92 40V 200mA) (1.Emitter 2.Base 3.Collector) P2N2222A - COM-12852 <http://www.sparkfun.com/products/12852> (TO-92 40V 600mA) (1.Collector 2.Base 3.Emitter); PROD_ID: TRANS-08049
U$1 = my-STMicroelectronics:M95M01-DWMN3TP/K: EEPROM Auto 1024Kb SPI bus EEPROM
U$2 = my-Espressif-Systems:ESP32-WROVER-E/IE: WiFi Modules - 802.11 SMD Module ESP32-WROVER-E, ESP32-D0WD-V3, 3.3V 64Mbit PSRAM, 8/16 MB SPI flash, PCB Antenna
U$3 = my-Microchip-Technology:MCP7940N-I/SN: Real Time Clock I2C GP RTCC 64B SRAM
U$4 = my-ECSInc:ECS-.327-12.5-12QS-TR: Crystals 32.786kHz 12.5pF 20ppm -40C +125C
U$5 = my-Microchip-Technology:48L512T-I/SN: SRAM Serial SRAM with Nonvolatile bits, 512K bit SPI
U$6 = my-Quectel:EC20CEFASG-MINIPCIE
U$7 = my-ROHMSemiconductor:BD48E30G-TR: Supervisory Circuits VOLTAGE DETECTOR. Vref = 3.0V
U$8 = my-Texas-Instruments:LM2576SX-3.3/NOPB: Switching Voltage Regulators 3A SD VTG Reg
U$9 = my-Molex:104224-0820: Memory Card Connectors nanoSIM 1.11mm Card Conn 6Ckt Push/Pull
U$10 = my-STMicroelectronics:ESDA6V1P6
U$11 = my-MicrochipTechnology:LAN8720A-CP: Ethernet ICs RMII 10/100 ETH XCVR w/HP AutoMDIXSupport
U$12 = my-WurthElektronik:7499010121A: LAN-Transformer WE-RJ45LAN 10/100BaseT
U$93 = my-ECSInc:ECS-250-20-30B-AEN-TR: Crystals 25MHz 25ppm 20pF -40C +85C